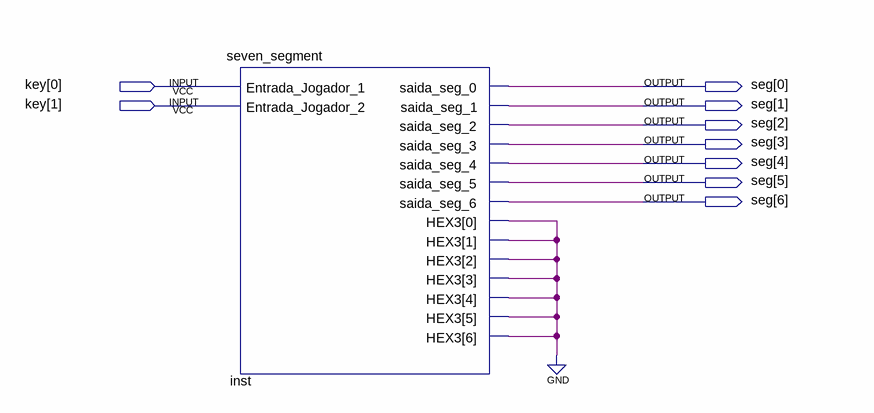
[diagram p0: schematic sheet]
// Quartus schematic top.bdf as structural Verilog: 1 symbols, 9 pins
module top (
  input  [1:0] key,
  output [6:0] seg
);

  wire inst_hex3;

  seven_segment inst (
    .Entrada_Jogador_1(key[0]), .Entrada_Jogador_2(key[1]), .saida_seg_0(seg[0]), .saida_seg_1(seg[1]),
    .saida_seg_2(seg[2]), .saida_seg_3(seg[3]), .saida_seg_4(seg[4]), .saida_seg_5(seg[5]),
    .saida_seg_6(seg[6]), .HEX3({7{inst_hex3}}));
  // also tied to GND on the sheet: inst_hex3
endmodule
